# EAGLE schematic schematic (EAGLE 9.6.2)
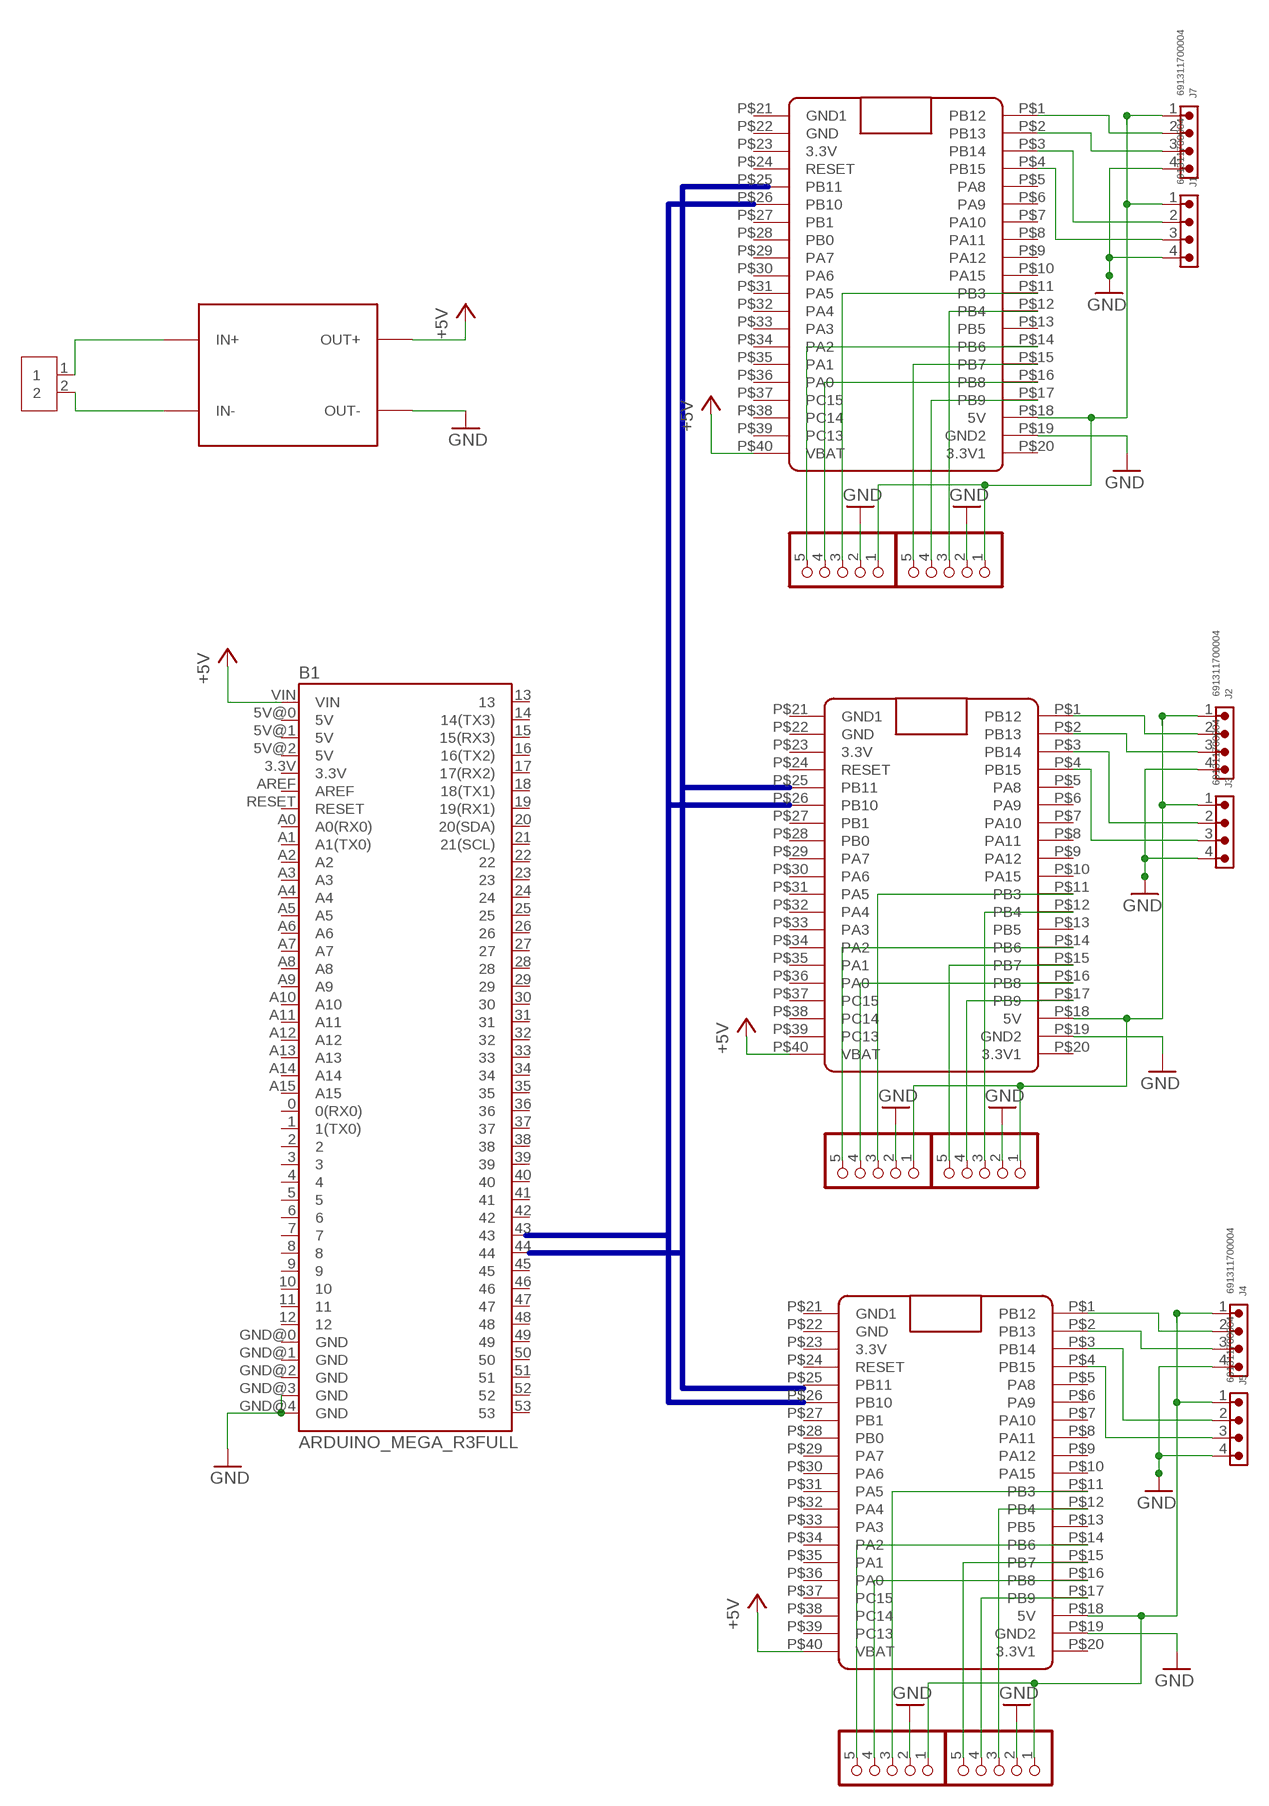
[diagram p0: schematic, sheet 1]

## Parts
B1  ARDUINO_MEGA_R3FULL  [ARDUINO_MEGA]
J1  691311700004  691311700004  [691311700004]
J2  691311700004  691311700004  [691311700004]
J3  691311700004  691311700004  [691311700004]
J4  691311700004  691311700004  [691311700004]
J5  691311700004  691311700004  [691311700004]
J7  691311700004  691311700004  [691311700004]
JP1  PINHD-1X5  [1X05]
JP2  PINHD-1X5  [1X05]
JP3  PINHD-1X5  [1X05]
JP4  PINHD-1X5  [1X05]
JP5  PINHD-1X5  [1X05]
JP6  PINHD-1X5  [1X05]
U$1  BLUE_PILL  [BLUE_PILL]
U$2  BLUE_PILL  [BLUE_PILL]
U$3  BLUE_PILL  [BLUE_PILL]
U$4  2828XX-2282837-2  [TERMBLK_508-2N]
U$5  DC-DC-STEP-DOWN-LM2596  [DC-DC-STEP-DOWN-LM2596]

## Nets
+5V: B1.VIN U$1.P$40(VBAT) U$2.P$40(VBAT) U$3.P$40(VBAT) U$5.OUT+
GND: B1.GND@3(GND) B1.GND@4(GND) J1.4 J2.4 J3.4 J4.4 J5.4 J7.4 JP1.2 JP2.2 JP3.2 JP4.2 JP5.2 JP6.2 U$1.P$19(GND2) U$2.P$19(GND2) U$3.P$19(GND2) U$5.OUT-
N$1: U$4.2 U$5.IN-
N$2: J7.2 U$1.P$1(PB12)
N$3: J7.3 U$1.P$2(PB13)
N$4: J1.2 U$1.P$3(PB14)
N$5: J1.3 U$1.P$4(PB15)
N$6: J2.2 U$2.P$1(PB12)
N$7: J2.3 U$2.P$2(PB13)
N$8: J3.2 U$2.P$3(PB14)
N$9: J3.3 U$2.P$4(PB15)
N$10: JP2.5 U$1.P$14(PB6)
N$11: JP1.5 U$1.P$15(PB7)
N$12: JP2.4 U$1.P$16(PB8)
N$13: JP1.4 U$1.P$17(PB9)
N$14: JP2.3 U$1.P$11(PB3)
N$15: JP1.3 U$1.P$12(PB4)
N$16: JP4.5 U$2.P$14(PB6)
N$17: JP3.5 U$2.P$15(PB7)
N$18: JP4.4 U$2.P$16(PB8)
N$19: JP3.4 U$2.P$17(PB9)
N$20: JP4.3 U$2.P$11(PB3)
N$21: JP3.3 U$2.P$12(PB4)
N$22: J4.2 U$3.P$1(PB12)
N$23: J4.3 U$3.P$2(PB13)
N$24: J5.2 U$3.P$3(PB14)
N$25: J5.3 U$3.P$4(PB15)
N$26: JP6.5 U$3.P$14(PB6)
N$27: JP5.5 U$3.P$15(PB7)
N$28: JP6.4 U$3.P$16(PB8)
N$29: JP5.4 U$3.P$17(PB9)
N$30: JP6.3 U$3.P$11(PB3)
N$31: JP5.3 U$3.P$12(PB4)
N$32: U$4.1 U$5.IN+
N$33: J1.1 J7.1 JP1.1 JP2.1 U$1.P$18(5V)
N$34: J2.1 J3.1 JP3.1 JP4.1 U$2.P$18(5V)
N$35: J4.1 J5.1 JP5.1 JP6.1 U$3.P$18(5V)
Unconnected: B1.0(0(RX0)) B1.1(1(TX0)) B1.2 B1.3 B1.3.3V B1.4 B1.5 B1.5V@0(5V) B1.5V@1(5V) B1.5V@2(5V) B1.6 B1.7 B1.8 B1.9 B1.10 B1.11 B1.12 B1.13 B1.14(14(TX3)) B1.15(15(RX3)) B1.16(16(TX2)) B1.17(17(RX2)) B1.18(18(TX1)) B1.19(19(RX1)) B1.20(20(SDA)) B1.21(21(SCL)) B1.22 B1.23 B1.24 B1.25 B1.26 B1.27 B1.28 B1.29 B1.30 B1.31 B1.32 B1.33 B1.34 B1.35 B1.36 B1.37 B1.38 B1.39 B1.40 B1.41 B1.42 B1.43 B1.44 B1.45 B1.46 B1.47 B1.48 B1.49 B1.50 B1.51 B1.52 B1.53 B1.A0(A0(RX0)) B1.A1(A1(TX0)) B1.A2 B1.A3 B1.A4 B1.A5 B1.A6 B1.A7 B1.A8 B1.A9 B1.A10 B1.A11 B1.A12 B1.A13 B1.A14 B1.A15 B1.AREF B1.GND@0(GND) B1.GND@1(GND) B1.GND@2(GND) B1.RESET U$1.P$5(PA8) U$1.P$6(PA9) U$1.P$7(PA10) U$1.P$8(PA11) U$1.P$9(PA12) U$1.P$10(PA15) U$1.P$13(PB5) U$1.P$20(3.3V1) U$1.P$22(GND) U$1.P$23(3.3V) U$1.P$24(RESET) U$1.P$25(PB11) U$1.P$26(PB10) U$1.P$27(PB1) U$1.P$28(PB0) U$1.P$29(PA7) U$1.P$30(PA6) U$1.P$31(PA5) U$1.P$32(PA4) U$1.P$33(PA3) U$1.P$34(PA2) U$1.P$35(PA1) U$1.P$36(PA0) U$1.P$37(PC15) U$1.P$38(PC14) U$1.P$39(PC13) U$2.P$5(PA8) U$2.P$6(PA9) U$2.P$7(PA10) U$2.P$8(PA11) U$2.P$9(PA12) U$2.P$10(PA15) U$2.P$13(PB5) U$2.P$20(3.3V1) U$2.P$22(GND) U$2.P$23(3.3V) U$2.P$24(RESET) U$2.P$25(PB11) U$2.P$26(PB10) U$2.P$27(PB1) U$2.P$28(PB0) U$2.P$29(PA7) U$2.P$30(PA6) U$2.P$31(PA5) U$2.P$32(PA4) U$2.P$33(PA3) U$2.P$34(PA2) U$2.P$35(PA1) U$2.P$36(PA0) U$2.P$37(PC15) U$2.P$38(PC14) U$2.P$39(PC13) U$3.P$5(PA8) U$3.P$6(PA9) U$3.P$7(PA10) U$3.P$8(PA11) U$3.P$9(PA12) U$3.P$10(PA15) U$3.P$13(PB5) U$3.P$20(3.3V1) U$3.P$22(GND) U$3.P$23(3.3V) U$3.P$24(RESET) U$3.P$25(PB11) U$3.P$26(PB10) U$3.P$27(PB1) U$3.P$28(PB0) U$3.P$29(PA7) U$3.P$30(PA6) U$3.P$31(PA5) U$3.P$32(PA4) U$3.P$33(PA3) U$3.P$34(PA2) U$3.P$35(PA1) U$3.P$36(PA0) U$3.P$37(PC15) U$3.P$38(PC14) U$3.P$39(PC13)

## Buses
I2C:SCL,SDA
B$1

## Power pins joined to a net without a drawn wire
GND1: U$1.P$21(GND1) U$2.P$21(GND1) U$3.P$21(GND1)

## Library data of the parts
B1 = SparkFun-Boards:ARDUINO_MEGA_R3: Arduino Mega R3 ATmega2560 R3 compatible footprint. SparkFun Products: Arduino Mega 2560 R3 <https://www.sparkfun.com/products/11061>
J1-J5 J7 = Wurth_Connectors_WR-TBL Pluggable Connector:691311700004: WR-TBL Serie 3117 - 5.00 mm Open Vertical PCB Header KIND PROPERTIES Pitch 5 mm MATERIAL PROPERTIES Insulator Material PBT Insulator Flammability Rating UL94 V-0 Contact Material Brass Contact Plating Tin GENERAL INFORMATION Operating Temperature -40 up to +105 °C Compliance RoHS ELECTRICAL PROPERTIES IR cULus 20 A IR VDE 20 A Working Voltage [cULus] 300 V (AC) Working Voltage [VDE] 300 V (AC) Withstanding Voltage [cULus] 1600 V (AC) Withstanding Voltage [VDE] 2500 V (AC) Contact Resistance [cULus] 20 mΩ Contact Resistance [VDE] 20 mΩ CERTIFICATION cULus Approval E315414 VDE Approval 40023195 <https://www.we-online.com/catalog/media/o60781v209%20Family_TBL_3_81_3103_HORIZONTAL_PCB_HEADER_W_FLANGES_6913103400XX.jpg> Details see: https://www.we-online.com/catalog/media/o33259v209%20Family_WR-TBL_69131170000x.jpg Updated by Ella Wu 2019-12-24 2019(C) Wurth Elektronik; DATASHEET-URL: https://www.we-online.com/catalog/datasheet/691311700004.pdf; IR-UL: 20A; IR-VDE: 20A; MOUNT: THT; PART-NUMBER: 691311700004; PINS: 4; PITCH: 5mm; TYPE: Vertical; WORKING-VOLTAGE-UL: 300V (AC); WORKING-VOLTAGE-VDE: 300V (AC)
JP1-JP6 = Connector:PINHD-1X5: PIN HEADER; CATEGORY: CONNECTOR; SUB-CATEGORY: PIN-HEADER
U$1-U$3 = BluePill:BLUE_PILL
U$4 = Connector:2828XX-2: 2 Position Wire to Board Terminal Block Horizontal with Board Datasheet <https://www.te.com.cn/commerce/DocumentDelivery/DDEController?Action=showdoc&DocId=Catalog+Section%7F1308389_EUROSTYLE_TERMINAL_BLOCKS%7F0607%7Fpdf%7FEnglish%7FENG_CS_1308389_EUROSTYLE_TERMINAL_BLOCKS_0607.pdf%7F2-282837-5>; CATEGORY: Connector; DESCRIPTION: 2 Position Wire to Board Terminal Block Horizontal with Board 5.08 mm Through Hole; MANUFACTURER: TE Connectivity; MPN: 282837-2; OPERATING_TEMPERATURE: -40°C to +105°C; PART_STATUS: ACTIVE; ROHS_COMPLIANCE: RoHS Compliant; SERIES: 282837; SUBCATEGORY: Terminal Block; TYPE: Side Wire Entry
U$5 = diy-modules:DC-DC-STEP-DOWN-LM2596: DC/DC Step-Down Regulator based on LM2596-ADJ chip LM2596 datasheet available here: http://www.ti.com/lit/ds/symlink/lm2596.pdf Click here to find device on ebay.com <http://www.ebay.com/sch/lm2596+power+regulator>